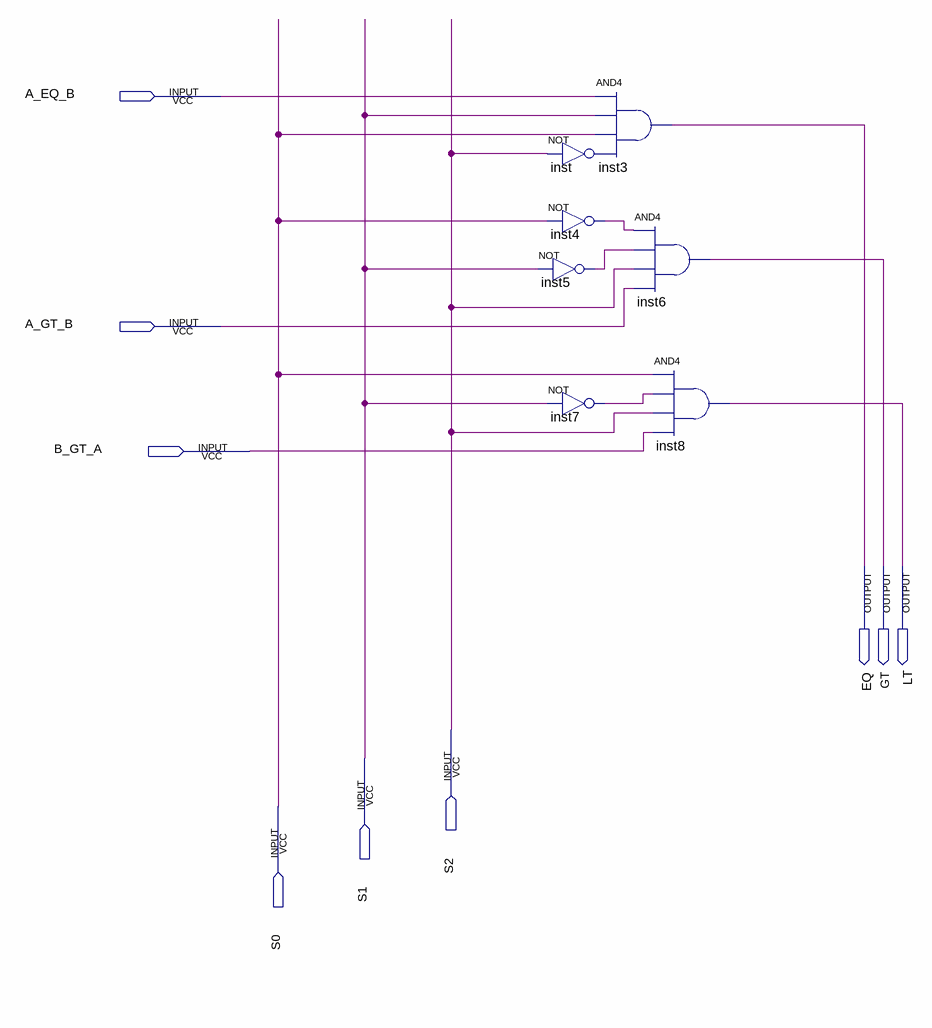
[diagram p0: schematic sheet]
// Quartus schematic multiplexador_simples.bdf as structural Verilog: 7 symbols, 9 pins
module multiplexador_simples (
  input  A_EQ_B,
  input  A_GT_B,
  input  B_GT_A,
  input  S2,
  input  S1,
  input  S0,
  output EQ,
  output GT,
  output LT
);

  wire inst4_out, inst5_out, inst7_out, inst_out;

  not inst (inst_out, S2);
  not inst4 (inst4_out, S0);
  not inst5 (inst5_out, S1);
  not inst7 (inst7_out, S1);
  and inst3 (EQ, A_EQ_B, S1, S0, inst_out);
  and inst6 (GT, inst4_out, inst5_out, S2, A_GT_B);
  and inst8 (LT, S0, inst7_out, S2, B_GT_A);
endmodule
